# EAGLE schematic battery_monitor_6803-2 -no_uno (EAGLE 7.3.0)
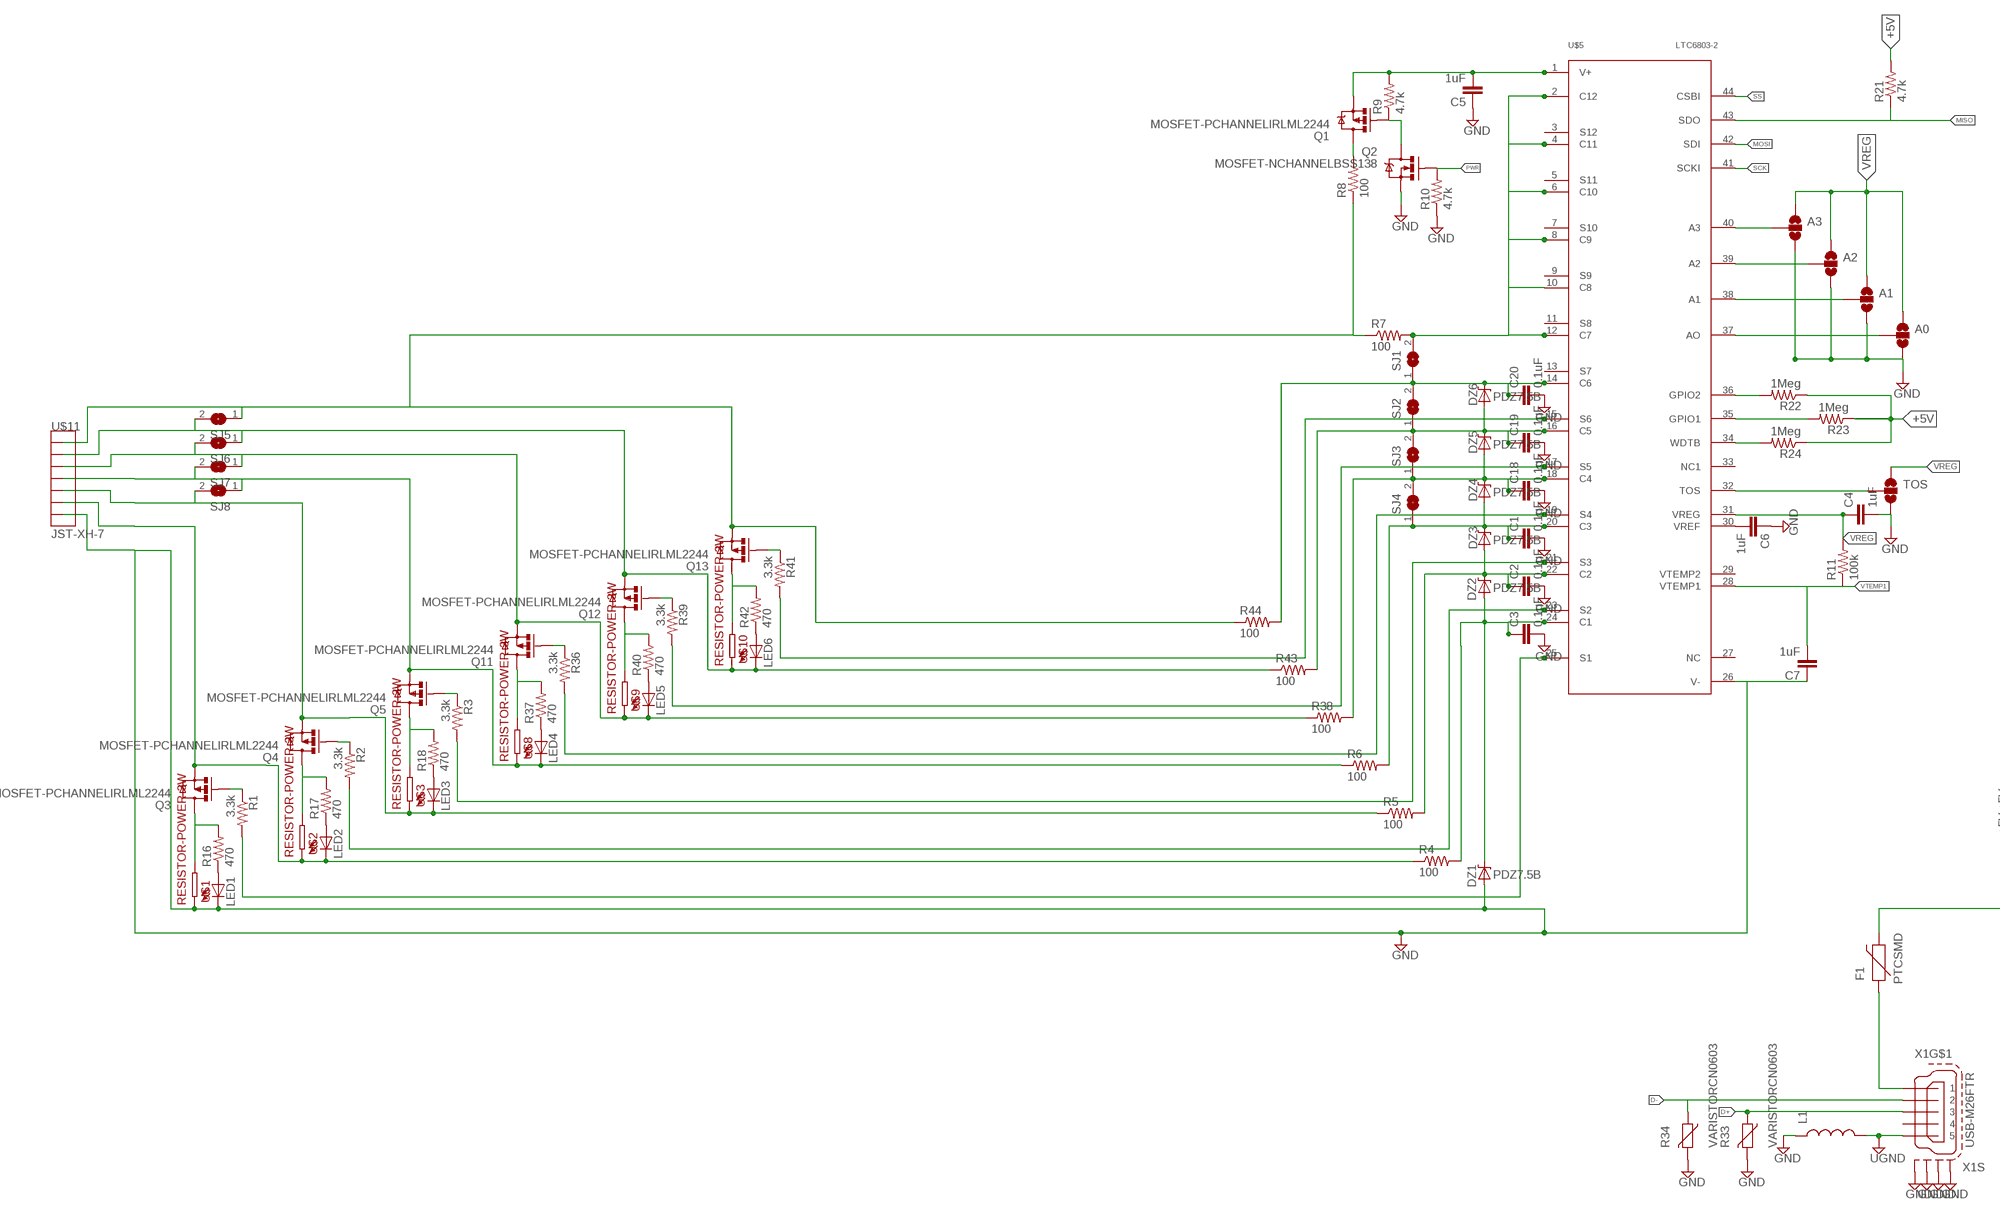
[diagram p0: schematic, sheet 1, part 1 of 2]
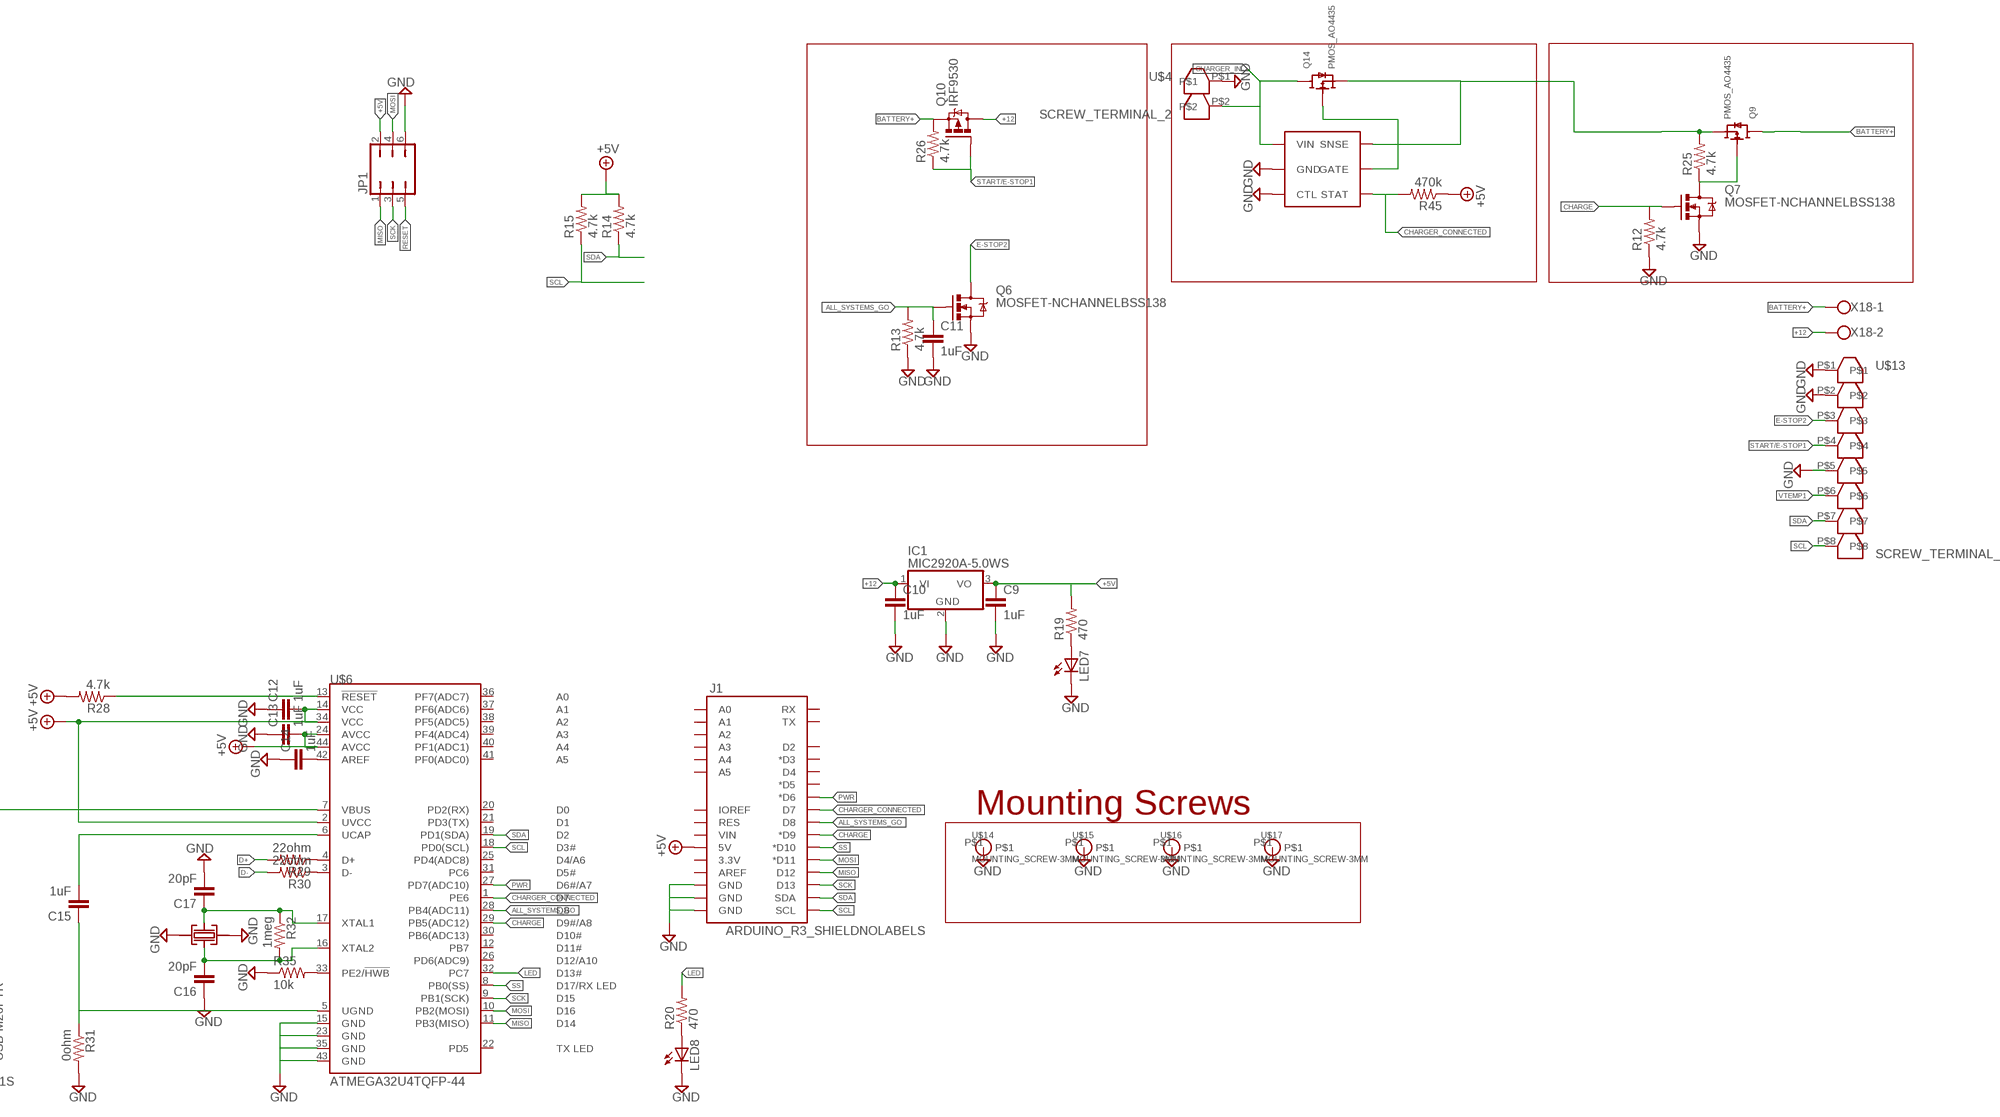
[diagram p1: schematic, sheet 1, part 2 of 2]

## Parts
A0  SOLDERJUMPER_2WAYS  [SJ_3]
A1  SOLDERJUMPER_2WAYS  [SJ_3]
A2  SOLDERJUMPER_2WAYS  [SJ_3]
A3  SOLDERJUMPER_2WAYS  [SJ_3]
C1  0.1uF  0.1UF-100V-10%(0603)  [0603-CAP]
C2  0.1uF  0.1UF-100V-10%(0603)  [0603-CAP]
C3  0.1uF  0.1UF-100V-10%(0603)  [0603-CAP]
C4  1uF  0.1UF-100V-10%(0603)  [0603-CAP]
C5  1uF  0.1UF-100V-10%(0603)  [0603-CAP]
C6  1uF  0.1UF-100V-10%(0603)  [0603-CAP]
C7  1uF  0.1UF-100V-10%(0603)  [0603-CAP]
C9  1uF  0.1UF-100V-10%(0603)  [0603-CAP]
C10  1uF  0.1UF-100V-10%(0603)  [0603-CAP]
C11  1uF  0.1UF-100V-10%(0603)  [0603-CAP]
C12  1uF  0.1UF-100V-10%(0603)  [0603-CAP]
C13  1uF  0.1UF-100V-10%(0603)  [0603-CAP]
C14  1uF  0.1UF-100V-10%(0603)  [0603-CAP]
C15  1uF  0.1UF-100V-10%(0603)  [0603-CAP]
C16  20pF  0.1UF-100V-10%(0603)  [0603-CAP]
C17  20pF  0.1UF-100V-10%(0603)  [0603-CAP]
C18  0.1uF  0.1UF-100V-10%(0603)  [0603-CAP]
C19  0.1uF  0.1UF-100V-10%(0603)  [0603-CAP]
C20  0.1uF  0.1UF-100V-10%(0603)  [0603-CAP]
DZ1  PDZ7.5B  DIODE-ZENER-BZT52  [SOD-323]
DZ2  PDZ7.5B  DIODE-ZENER-BZT52  [SOD-323]
DZ3  PDZ7.5B  DIODE-ZENER-BZT52  [SOD-323]
DZ4  PDZ7.5B  DIODE-ZENER-BZT52  [SOD-323]
DZ5  PDZ7.5B  DIODE-ZENER-BZT52  [SOD-323]
DZ6  PDZ7.5B  DIODE-ZENER-BZT52  [SOD-323]
F1  PTCSMD  [PTC-1206]
IC1  MIC2920A-5.0WS  MCP1703DB  [SOT223]
J1  ARDUINO_R3_SHIELDNOLABELS  [UNO_R3_SHIELD_NOLABELS]
JP1  JP3Q  [JP3Q]
L1  INDUCTOR0805  [0805]
LED1  LED0603  [LED-0603]
LED2  LED0603  [LED-0603]
LED3  LED0603  [LED-0603]
LED4  LED0603  [LED-0603]
LED5  LED0603  [LED-0603]
LED6  LED0603  [LED-0603]
LED7  LED0603  [LED-0603]
LED8  LED0603  [LED-0603]
Q1  MOSFET-PCHANNELIRLML2244  [SOT23-3]
Q2  MOSFET-NCHANNELBSS138  [SOT23]
Q3  MOSFET-PCHANNELIRLML2244  [SOT23-3]
Q4  MOSFET-PCHANNELIRLML2244  [SOT23-3]
Q5  MOSFET-PCHANNELIRLML2244  [SOT23-3]
Q6  MOSFET-NCHANNELBSS138  [SOT23]
Q7  MOSFET-NCHANNELBSS138  [SOT23]
Q9  PMOS_AO4435  [SOIC8]
Q10  IRF9530  [TO220BV]
Q11  MOSFET-PCHANNELIRLML2244  [SOT23-3]
Q12  MOSFET-PCHANNELIRLML2244  [SOT23-3]
Q13  MOSFET-PCHANNELIRLML2244  [SOT23-3]
Q14  PMOS_AO4435  [SOIC8]
R1  3.3k  3.3KOHM1/10W1%(0603)  [0603-RES]
R2  3.3k  3.3KOHM1/10W1%(0603)  [0603-RES]
R3  3.3k  3.3KOHM1/10W1%(0603)  [0603-RES]
R4  100  3.3KOHM1/10W1%(0603)  [0603-RES]
R5  100  3.3KOHM1/10W1%(0603)  [0603-RES]
R6  100  3.3KOHM1/10W1%(0603)  [0603-RES]
R7  100  3.3KOHM1/10W1%(0603)  [0603-RES]
R8  100  3.3KOHM1/10W1%(0603)  [0603-RES]
R9  4.7k  3.3KOHM1/10W1%(0603)  [0603-RES]
R10  4.7k  3.3KOHM1/10W1%(0603)  [0603-RES]
R11  100k  3.3KOHM1/10W1%(0603)  [0603-RES]
R12  4.7k  3.3KOHM1/10W1%(0603)  [0603-RES]
R13  4.7k  3.3KOHM1/10W1%(0603)  [0603-RES]
R14  4.7k  3.3KOHM1/10W1%(0603)  [0603-RES]
R15  4.7k  3.3KOHM1/10W1%(0603)  [0603-RES]
R16  470  3.3KOHM1/10W1%(0603)  [0603-RES]
R17  470  3.3KOHM1/10W1%(0603)  [0603-RES]
R18  470  3.3KOHM1/10W1%(0603)  [0603-RES]
R19  470  3.3KOHM1/10W1%(0603)  [0603-RES]
R20  470  3.3KOHM1/10W1%(0603)  [0603-RES]
R21  4.7k  3.3KOHM1/10W1%(0603)  [0603-RES]
R22  1Meg  3.3KOHM1/10W1%(0603)  [0603-RES]
R23  1Meg  3.3KOHM1/10W1%(0603)  [0603-RES]
R24  1Meg  3.3KOHM1/10W1%(0603)  [0603-RES]
R25  4.7k  3.3KOHM1/10W1%(0603)  [0603-RES]
R26  4.7k  3.3KOHM1/10W1%(0603)  [0603-RES]
R28  4.7k  3.3KOHM1/10W1%(0603)  [0603-RES]
R29  22ohm  3.3KOHM1/10W1%(0603)  [0603-RES]
R30  22ohm  3.3KOHM1/10W1%(0603)  [0603-RES]
R31  0ohm  3.3KOHM1/10W1%(0603)  [0603-RES]
R32  1meg  3.3KOHM1/10W1%(0603)  [0603-RES]
R33  VARISTORCN0603  [CT/CN0603]
R34  VARISTORCN0603  [CT/CN0603]
R35  10k  3.3KOHM1/10W1%(0603)  [0603-RES]
R36  3.3k  3.3KOHM1/10W1%(0603)  [0603-RES]
R37  470  3.3KOHM1/10W1%(0603)  [0603-RES]
R38  100  3.3KOHM1/10W1%(0603)  [0603-RES]
R39  3.3k  3.3KOHM1/10W1%(0603)  [0603-RES]
R40  470  3.3KOHM1/10W1%(0603)  [0603-RES]
R41  3.3k  3.3KOHM1/10W1%(0603)  [0603-RES]
R42  470  3.3KOHM1/10W1%(0603)  [0603-RES]
R43  100  3.3KOHM1/10W1%(0603)  [0603-RES]
R44  100  3.3KOHM1/10W1%(0603)  [0603-RES]
R45  470k  3.3KOHM1/10W1%(0603)  [0603-RES]
SJ1  SJ  [SJ]
SJ2  SJ  [SJ]
SJ3  SJ  [SJ]
SJ4  SJ  [SJ]
SJ5  SJ  [SJ]
SJ6  SJ  [SJ]
SJ7  SJ  [SJ]
SJ8  SJ  [SJ]
TOS  SOLDERJUMPER_2WAYS  [SJ_3]
U$1  RESISTOR-POWER-3W  [RESISTOR-3W]
U$2  RESISTOR-POWER-3W  [RESISTOR-3W]
U$3  RESISTOR-POWER-3W  [RESISTOR-3W]
U$4  SCREW_TERMINAL_2  [SCREW_TERMINAL_2]
U$5  LTC6803-2  [FSOP-44]
U$6  ATMEGA32U4TQFP-44  [TQFP44]
U$7  CRYSTAL_403  [CRYSTAL(DFN,LCC)]
U$8  RESISTOR-POWER-3W  [RESISTOR-3W]
U$9  RESISTOR-POWER-3W  [RESISTOR-3W]
U$10  RESISTOR-POWER-3W  [RESISTOR-3W]
U$11  JST-XH-7  [JST-XH-7]
U$12  LTC4412  [SOT-23-6]
U$13  SCREW_TERMINAL_8  [SCREW_TERMINAL_8]
U$14  MOUNTING_SCREW-3MM  [MOUNTING_SCREW-3MM]
U$15  MOUNTING_SCREW-3MM  [MOUNTING_SCREW-3MM]
U$16  MOUNTING_SCREW-3MM  [MOUNTING_SCREW-3MM]
U$17  MOUNTING_SCREW-3MM  [MOUNTING_SCREW-3MM]
X1  USB-M26FTR  MINI-USB-SCHIELD-32005-301  [32005-301]
X18  W237-102  [W237-102]

## Nets
+5V: C9.1 C12.2 C13.2 IC1.3(VO) J1.5V JP1.2 R14.2 R15.2 R19.2 R21.2 R22.1 R23.1 R24.1 R28.2 R45.1 U$6.2(UVCC) U$6.14(VCC) U$6.24(AVCC) U$6.34(VCC) U$6.44(AVCC)
+12: C10.1 IC1.1(VI) Q10.D X18.2
ALL_SYSTEMS_GO: C11.1 J1.D8 Q6.1(G) R13.2 U$6.28(PB4(ADC11))
BATTERY+: Q9.5(DRAIN) Q9.6(DRAIN) Q9.7(DRAIN) Q9.8(DRAIN) Q10.S R26.2 X18.1
CHARGE: J1.D9(*D9) Q7.1(G) R12.2 U$6.29(PB5(ADC12))
CHARGER_CONNECTED: J1.D7 R45.2 U$6.1(PE6) U$12.P$4(STAT)
CHARGER_IN: Q14.5(DRAIN) Q14.6(DRAIN) Q14.7(DRAIN) Q14.8(DRAIN) U$4.P$2 U$12.P$1(VIN)
D+: R29.2 R33.1 X1.3
D-: R30.2 R34.1 X1.2
E-STOP2: Q6.3(D) U$13.P$3
GND: A0.3 A1.3 A2.3 A3.3 C1.2 C2.2 C3.2 C4.2 C5.1 C6.1 C7.1 C9.2 C10.2 C11.2 C12.1 C13.1 C14.1 C16.1 C17.2 C18.2 C19.2 C20.2 DZ1.2(A) IC1.2(GND) J1.GND@0(GND) J1.GND@1(GND) J1.GND@2(GND) JP1.6 L1.1 LED1.C LED7.C LED8.C Q2.2(S) Q6.2(S) Q7.2(S) R10.1 R12.1 R13.1 R31.2 R33.2 R34.2 R35.1 TOS.3 U$1.P$2 U$4.P$1 U$5.26(V-) U$6.15(GND) U$6.23(GND) U$6.35(GND) U$6.43(GND) U$7.CASE U$7.CASE1 U$11.1 U$12.P$2(GND) U$12.P$3(CTL) U$13.P$1 U$13.P$2 U$13.P$5 U$14.P$1 U$15.P$1 U$16.P$1 U$17.P$1 X1.M1(S:S1) X1.M2(S:S2) X1.M3(S:S3) X1.M4(S:S4)
LED: R20.2 U$6.32(PC7)
MISO: J1.D12 JP1.1 R21.1 U$5.43(SDO) U$6.11(PB3(MISO))
MOSI: J1.D11(*D11) JP1.4 U$5.42(SDI) U$6.10(PB2(MOSI))
N$1: Q7.3(D) Q9.4(GATE) R25.1
N$2: LED2.C Q3.2(S) R4.1 U$2.P$2 U$11.2
N$3: LED3.C Q4.2(S) R5.1 SJ8.2 U$3.P$2 U$11.3
N$4: LED4.C Q5.2(S) R6.1 SJ7.2 SJ8.1 U$8.P$2 U$11.4
N$5: Q3.3(D) R16.2 U$1.P$1
N$6: R2.2 U$5.23(S2)
N$7: Q3.1(G) R1.1
N$8: R1.2 U$5.25(S1)
N$9: R3.2 U$5.21(S3)
N$10: Q4.3(D) R17.2 U$2.P$1
N$11: Q4.1(G) R2.1
N$12: Q5.3(D) R18.2 U$3.P$1
N$13: LED1.A R16.1
N$14: C1.1 DZ3.1(C) DZ4.2(A) R6.2 SJ4.1 U$5.20(C3)
N$15: C3.1 DZ1.1(C) DZ2.2(A) R4.2 U$5.24(C1)
N$16: C2.1 DZ2.1(C) DZ3.2(A) R5.2 U$5.22(C2)
N$17: R7.2 SJ1.2 U$5.2(C12) U$5.4(C11) U$5.6(C10) U$5.8(C9) U$5.10(C8) U$5.12(C7)
N$18: Q1.3(D) R8.2
N$19: C5.2 Q1.2(S) R9.2 U$5.1(V+)
N$20: Q1.1(G) Q2.3(D) R9.1
N$21: LED7.A R19.1
N$22: LED2.A R17.1
N$23: LED3.A R18.1
N$24: R22.2 U$5.36(GPIO2)
N$25: R23.2 U$5.35(GPIO1)
N$27: R24.2 U$5.34(WDTB)
N$28: A3.2 U$5.40(A3)
N$29: Q5.1(G) R3.1
N$30: A2.2 U$5.39(A2)
N$31: A1.2 U$5.38(A1)
N$32: A0.2 U$5.37(AO)
N$33: TOS.2 U$5.32(TOS)
N$34: C6.2 U$5.30(VREF)
N$35: LED8.A R20.1
N$36: C15.2 U$6.6(UCAP)
N$37: F1.1 X1.1
N$38: C14.2 U$6.42(AREF)
N$39: R35.2 U$6.33(PE2/!HWB)
N$40: R36.2 U$5.19(S4)
N$41: Q11.1(G) R36.1
N$42: Q11.3(D) R37.2 U$8.P$1
N$43: LED4.A R37.1
N$44: R29.1 U$6.4(D+)
N$45: R30.1 U$6.3(D-)
N$46: LED5.C Q11.2(S) R38.1 SJ6.2 SJ7.1 U$9.P$2 U$11.5
N$48: R39.2 U$5.17(S5)
N$49: Q12.1(G) R39.1
N$50: F1.2 U$6.7(VBUS)
N$51: C17.1 R32.1 U$6.17(XTAL1) U$7.IN
N$52: C16.2 R32.2 U$6.16(XTAL2) U$7.OUT
N$53: Q12.3(D) R40.2 U$9.P$1
N$54: LED5.A R40.1
N$55: C18.1 DZ4.1(C) DZ5.2(A) R38.2 SJ3.1 SJ4.2 U$5.18(C4)
N$56: LED6.C Q12.2(S) R43.1 SJ5.2 SJ6.1 U$10.P$2 U$11.6
N$58: R41.2 U$5.15(S6)
N$59: Q13.1(G) R41.1
N$60: Q9.1(SOURCE) Q9.2(SOURCE) Q9.3(SOURCE) Q14.1(SOURCE) Q14.2(SOURCE) Q14.3(SOURCE) R25.2 U$12.P$6(SNSE)
N$61: LED6.A R42.1
N$62: C19.1 DZ5.1(C) DZ6.2(A) R43.2 SJ2.1 SJ3.2 U$5.16(C5)
N$63: Q13.2(S) R7.1 R8.1 R44.1 SJ5.1 U$11.7
N$64: C20.1 DZ6.1(C) R44.2 SJ1.1 SJ2.2 U$5.14(C6)
N$67: Q14.4(GATE) U$12.P$5(GATE)
N$601: Q13.3(D) R42.2 U$10.P$1
PWR: J1.D6(*D6) Q2.1(G) R10.2 U$6.27(PD7(ADC10))
RESET: JP1.5 R28.1 U$6.13(!RESET)
SCK: J1.D13 JP1.3 U$5.41(SCKI) U$6.9(PB1(SCK))
SCL: J1.SCL R15.1 U$6.18(PD0(SCL)) U$13.P$8
SDA: J1.SDA R14.1 U$6.19(PD1(SDA)) U$13.P$7
SS: J1.D10(*D10) U$5.44(CSBI) U$6.8(PB0(SS))
START/E-STOP1: Q10.G R26.1 U$13.P$4
UGND: C15.1 L1.2 R31.1 U$6.5(UGND) X1.5
VREG: A0.1 A1.1 A2.1 A3.1 C4.1 R11.2 TOS.1 U$5.31(VREG)
VTEMP1: C7.2 R11.1 U$5.28(VTEMP1) U$13.P$6
Unconnected: J1.3.3V J1.A0 J1.A1 J1.A2 J1.A3 J1.A4 J1.A5 J1.AREF J1.D2 J1.D3(*D3) J1.D4 J1.D5(*D5) J1.IOREF J1.RES J1.RX J1.TX J1.VIN U$5.3(S12) U$5.5(S11) U$5.7(S10) U$5.9(S9) U$5.11(S8) U$5.13(S7) U$5.27(NC) U$5.29(VTEMP2) U$5.33(NC1) U$6.12(PB7) U$6.20(PD2(RX)) U$6.21(PD3(TX)) U$6.22(PD5) U$6.25(PD4(ADC8)) U$6.26(PD6(ADC9)) U$6.30(PB6(ADC13)) U$6.31(PC6) U$6.36(PF7(ADC7)) U$6.37(PF6(ADC6)) U$6.38(PF5(ADC5)) U$6.39(PF4(ADC4)) U$6.40(PF1(ADC1)) U$6.41(PF0(ADC0)) X1.4

## Notes on the sheet
- Mounting Screws

## Library data of the parts
A0 A1-A3 TOS = SparkFun:SOLDERJUMPER_2WAY: Solder Jumper 2 way solder jumper; OC_NEWARK: unknown
C1-C3 C18-C20 = SparkFun-Capacitors:0.1UF-100V-10%(0603): CAP-08390; MPN: 0402ZD104KAT2A; OC_NEWARK: 96M1117; PROD_ID: CAP-08390
C4-C7 C9-C17 = SparkFun-Capacitors:0.1UF-100V-10%(0603): CAP-08390; OC_NEWARK: unknown; PROD_ID: CAP-08390; VALUE: 0.1uF
DZ1-DZ6 = SparkFun-DiscreteSemi:DIODE-ZENER: Zener Diode Production Part - 8199 3.4V Zener Voltage; OC_NEWARK: unknown
F1 = SparkFun-PowerIC:PTC: Resettable Fuse PTC Resettable Fuse. Spark Fun Electronics SKU : COM-08357; OC_NEWARK: unknown; PROD_ID: RES-11150
IC1 = linear:MCP1703: 250 mA, 16V, Low Quiescent Current LDO Regulator Source: http://ww1.microchip.com/downloads/en/DeviceDoc/22049b.pdf; OC_NEWARK: unknown
J1 = SparkFun-Boards:ARDUINO_R3_SHIELD: Shield form compatible with the Arduino Uno R3.; OC_NEWARK: unknown
JP1 = jumper:JP3Q: JUMPER; OC_NEWARK: unknown
L1 = SparkFun-Passives:INDUCTOR: Inductors Basic Inductor/Choke - 0603 and 1206. Footprints are not proven and vary greatly between part numbers. INDUCTOR POWER 3.3UH 4.0A SMD 0.197" L x 0.197" W x 0.177" H (5.00mm x 5.00mm x 4.50mm); OC_NEWARK: unknown
LED1-LED8 = SparkFun-LED:LED: LEDs Standard schematic elements and footprints for 5mm, 3mm, 1206, and 0603 sized LEDs. 5mm - Spark Fun Electronics SKU : COM-00529 (and others); OC_NEWARK: unknown
Q1 Q3-Q5 Q11-Q13 = SparkFun-DiscreteSemi:MOSFET-PCHANNEL: Generic PMOSFET; OC_NEWARK: unknown; PROD_ID: TRANS-11153
Q2 Q6 Q7 = SparkFun-DiscreteSemi:MOSFET-NCHANNEL: Common NMOSFET Parts MFG P/N Store ID Prod ID FDD8780 TRANS-09984 SI7820DN TRANS-11055 FDS6630A IC-08089 2N7002PW TRANS-11151 FQP30N06L COM-10213 TRANS-10060 BSS123LT1G TRANS-08345 BSS138 TRANS-00830 BS170 2N7000; OC_NEWARK: unknown; PROD_ID: TRANS-00830
Q9 Q14 = isaac1:PMOS_AO4435; OC_NEWARK: unknown
Q10 = Adams Chips:IRF9530: P-CHANNEL HEXFET POWER-MOS-FET Source: http://www.irf.com/product-info/datasheets/data/irf9530.pdf; OC_NEWARK: unknown
R1-R26 R28-R32 R35-R45 = SparkFun-Resistors:3.3KOHM1/10W1%(0603): RES-07851; OC_NEWARK: unknown; PROD_ID: RES-07851
R33 R34 = varistor:VARISTOR: VARISTOR; OC_NEWARK: unknown
SJ1-SJ8 = jumper:SJ: SMD solder JUMPER; OC_NEWARK: unknown
U$1-U$3 U$8-U$10 = isaac1:RESISTOR-POWER-3W: PR03 series .205" dia x .657" L; OC_NEWARK: unknown
U$4 = isaac1:SCREW_TERMINAL_2; OC_NEWARK: unknown
U$5 = isaac1:LTC6803-2; OC_NEWARK: unknown
U$6 = SparkFun-DigitalIC:ATMEGA32U4: Atmel 44-pin 8-bit Microcontroller with 32KBytes of ISP Flash and USB Controller; OC_NEWARK: unknown
U$7 = isaac1:CRYSTAL_403; OC_NEWARK: unknown
U$11 = isaac1:JST-XH-7; OC_NEWARK: unknown
U$12 = isaac1:LTC4412; OC_NEWARK: unknown
U$13 = isaac1:SCREW_TERMINAL_8; OC_NEWARK: unknown
U$14-U$17 = isaac1:MOUNTING_SCREW-3MM; OC_NEWARK: unknown
X1 = con-cypressindustries:MINI-USB-SCHIELD-: MINI USB-B Conector Source: www.cypressindustries.com; OC_FARNELL: unknown; OC_NEWARK: unknown
X18 = con-wago-500:W237-102: WAGO SCREW CLAMP; MPN: 237-102; OC_FARNELL: unknown; OC_NEWARK: unknown